# Altium project ATOL_MAIN_BOARD_R02A03_20191009.PrjPcb
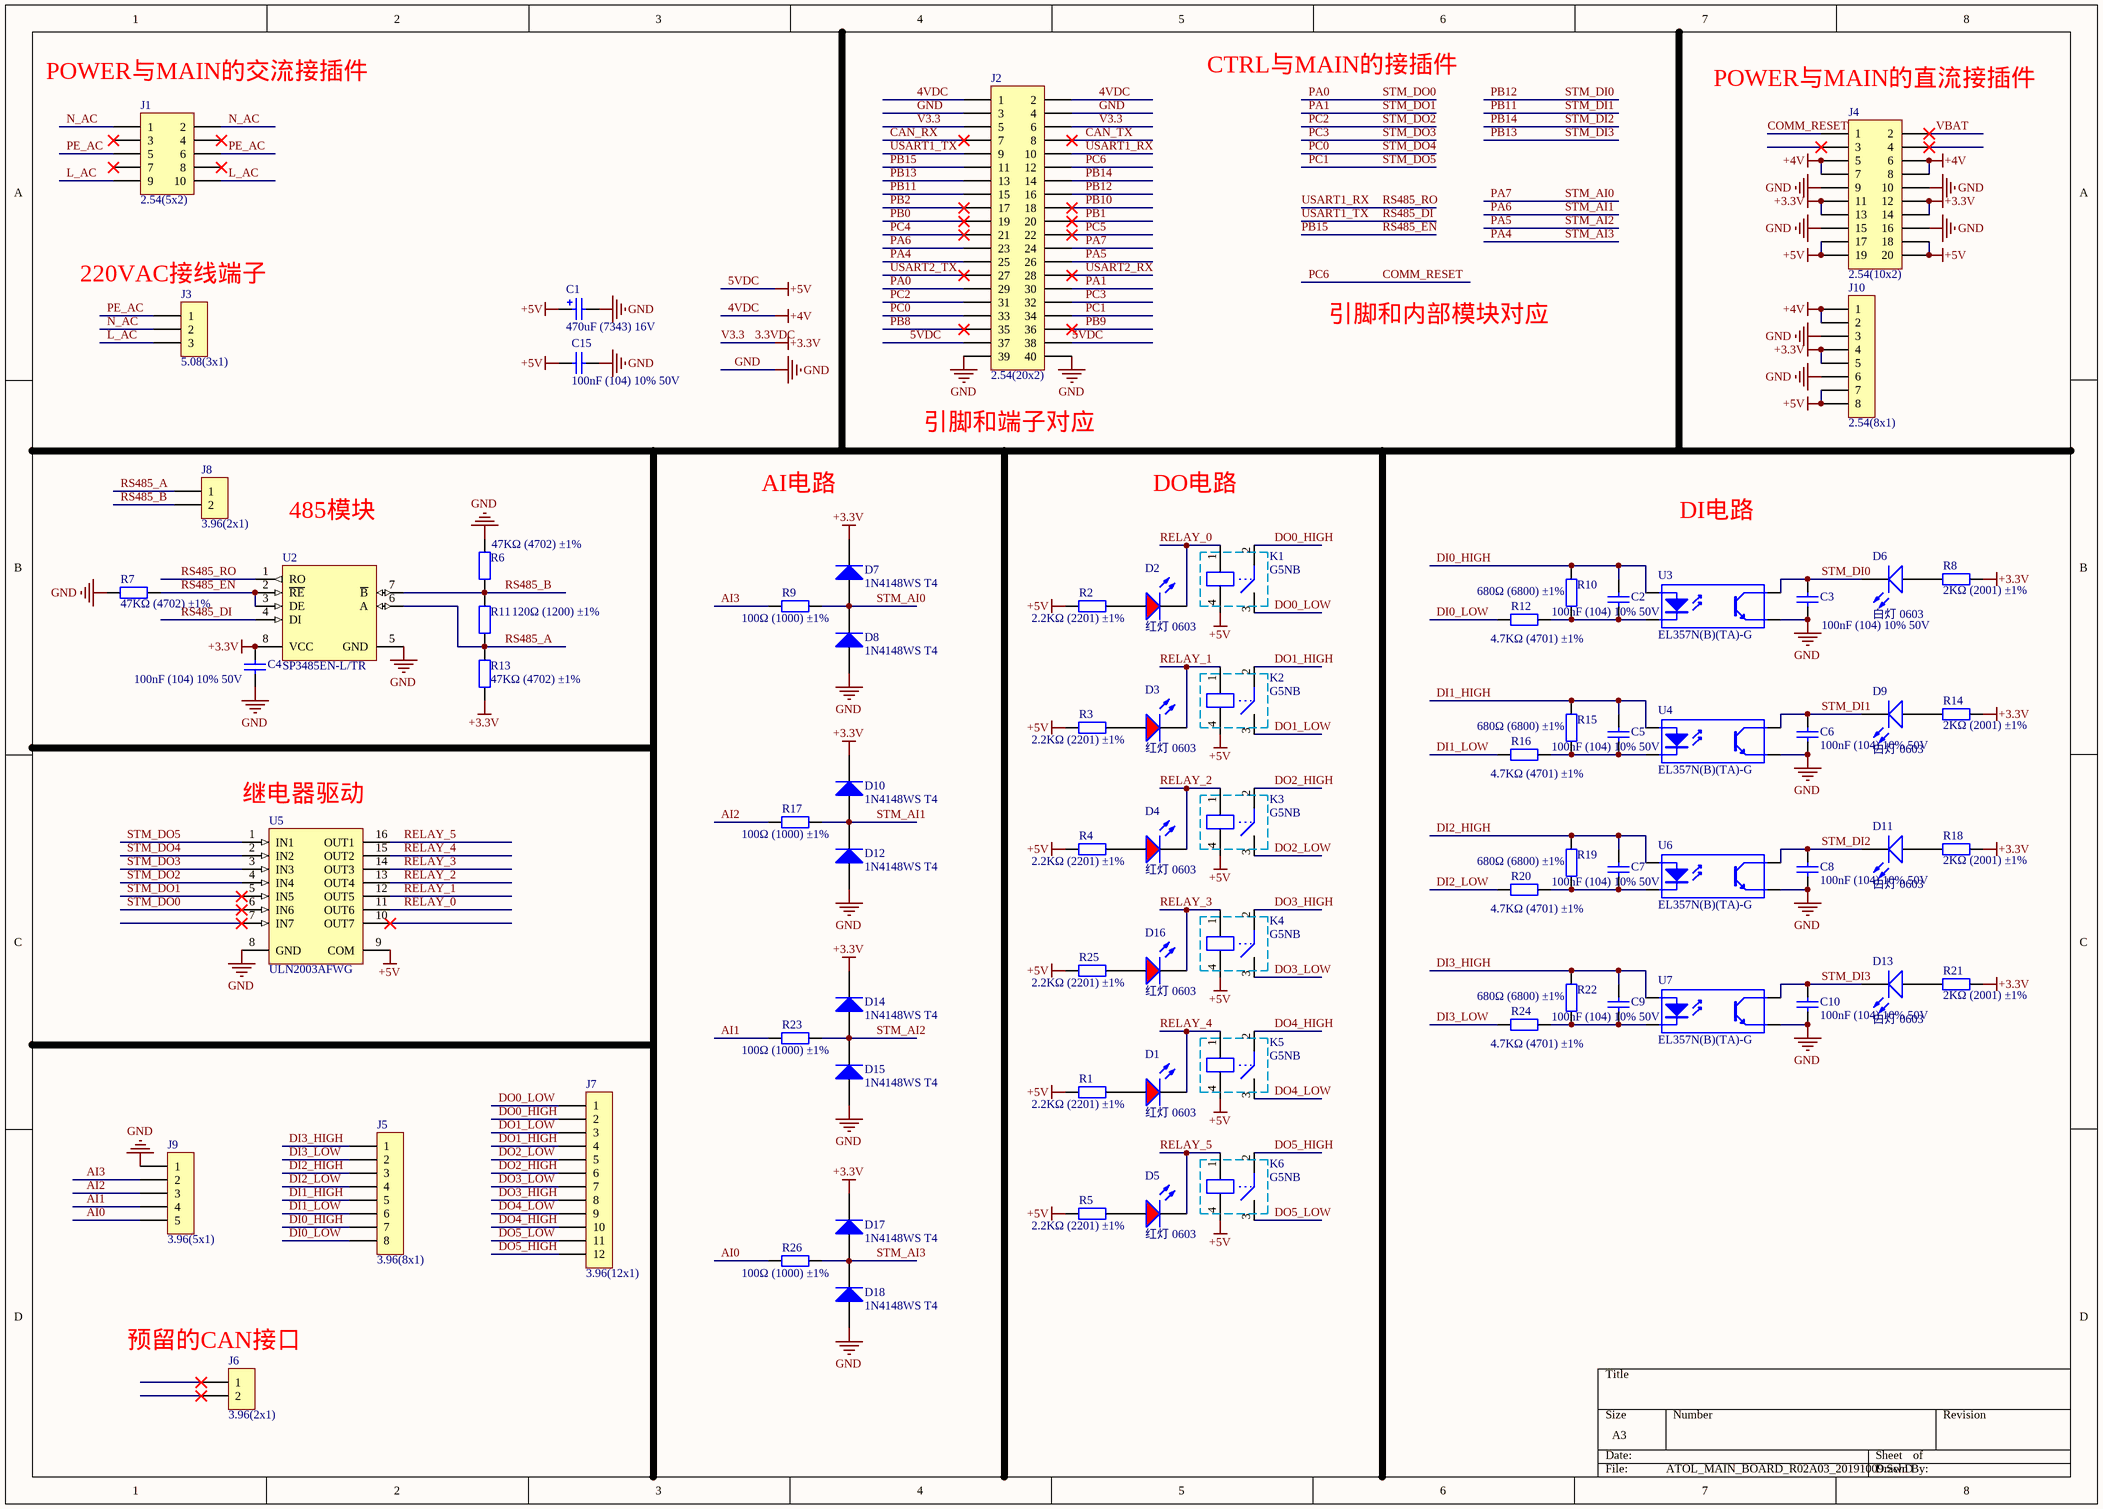
[diagram p0: ATOL_MAIN_BOARD_R02A03_20191009.SchDoc]
1 sheet, 77 parts. Net scope: global (net labels, ports and power ports of the same name join across sheets).
Board file: ATOL_MAIN_BOARD_R02A03_20191009.PcbDoc

## Sheet ATOL_MAIN_BOARD_R02A03_20191009.SchDoc
size A3

### Parts
C1  470uF (7343) 16V  [STEC_E(7343-43)]
C2  100nF (104) 10% 50V  [0603_C]
C3  100nF (104) 10% 50V  [0603_C]
C4  100nF (104) 10% 50V  [0603_C]
C5  100nF (104) 10% 50V  [0603_C]
C6  100nF (104) 10% 50V  [0603_C]
C7  100nF (104) 10% 50V  [0603_C]
C8  100nF (104) 10% 50V  [0603_C]
C9  100nF (104) 10% 50V  [0603_C]
C10  100nF (104) 10% 50V  [0603_C]
C15  100nF (104) 10% 50V  [0603_C]
D1  红灯 0603  [0603_LED_S1]
D2  红灯 0603  [0603_LED_S1]
D3  红灯 0603  [0603_LED_S1]
D4  红灯 0603  [0603_LED_S1]
D5  红灯 0603  [0603_LED_S1]
D6  白灯 0603  [0603_LED_S1]
D7  1N4148WS T4  [SOD-323]
D8  1N4148WS T4  [SOD-323]
D9  白灯 0603  [0603_LED_S1]
D10  1N4148WS T4  [SOD-323]
D11  白灯 0603  [0603_LED_S1]
D12  1N4148WS T4  [SOD-323]
D13  白灯 0603  [0603_LED_S1]
D14  1N4148WS T4  [SOD-323]
D15  1N4148WS T4  [SOD-323]
D16  红灯 0603  [0603_LED_S1]
D17  1N4148WS T4  [SOD-323]
D18  1N4148WS T4  [SOD-323]
J1  2.54(5x2)  [DB2.54(5x2)]
J2  2.54(20x2)  [DB2.54(20x2)]
J3  5.08(3x1)  [KF2EDGK5.08-WI-3P]
J4  2.54(10x2)  [DB2.54(10x2)]
J5  3.96(8x1)  [HT3.96-WI-8P]
J6  3.96(2x1)  [HT3.96-WI-2P]
J7  3.96(12x1)  [HT3.96-WI-12P]
J8  3.96(2x1)  [HT3.96-WI-2P]
J9  3.96(5x1)  [HT3.96-WI-5P]
J10  2.54(8x1)  [DB2.54(8x1)]
K1  G5NB  [G5NG]
K2  G5NB  [G5NG]
K3  G5NB  [G5NG]
K4  G5NB  [G5NG]
K5  G5NB  [G5NG]
K6  G5NB  [G5NG]
R1  2.2KΩ (2201) ±1%  [0603_R]
R2  2.2KΩ (2201) ±1%  [0603_R]
R3  2.2KΩ (2201) ±1%  [0603_R]
R4  2.2KΩ (2201) ±1%  [0603_R]
R5  2.2KΩ (2201) ±1%  [0603_R]
R6  47KΩ (4702) ±1%  [0603_R]
R7  47KΩ (4702) ±1%  [0603_R]
R8  2KΩ (2001) ±1%  [0603_R]
R9  100Ω (1000) ±1%  [0603_R]
R10  680Ω (6800) ±1%  [0603_R]
R11  120Ω (1200) ±1%  [0603_R]
R12  4.7KΩ (4701) ±1%  [0603_R]
R13  47KΩ (4702) ±1%  [0603_R]
R14  2KΩ (2001) ±1%  [0603_R]
R15  680Ω (6800) ±1%  [0603_R]
R16  4.7KΩ (4701) ±1%  [0603_R]
R17  100Ω (1000) ±1%  [0603_R]
R18  2KΩ (2001) ±1%  [0603_R]
R19  680Ω (6800) ±1%  [0603_R]
R20  4.7KΩ (4701) ±1%  [0603_R]
R21  2KΩ (2001) ±1%  [0603_R]
R22  680Ω (6800) ±1%  [0603_R]
R23  100Ω (1000) ±1%  [0603_R]
R24  4.7KΩ (4701) ±1%  [0603_R]
R25  2.2KΩ (2201) ±1%  [0603_R]
R26  100Ω (1000) ±1%  [0603_R]
U2  SP3485EN-L/TR  [SOIC-8_150mil]
U3  EL357N(B)(TA)-G  [SOP-4_P2.54]
U4  EL357N(B)(TA)-G  [SOP-4_P2.54]
U5  ULN2003AFWG  [SOIC-16_150mil]
U6  EL357N(B)(TA)-G  [SOP-4_P2.54]
U7  EL357N(B)(TA)-G  [SOP-4_P2.54]

### Nets
3.3VDC: C4.1 D7.2(K) D10.2(K) D14.2(K) D17.2(K) J2.5 J2.6 J4.11 J4.12 J4.13 J4.14 J10.4 J10.5 R8.2 R13.1 R14.2 R18.2 R21.2 U2.8(VCC)  [also labelled +3.3V, V3.3]
4VDC: J2.1 J2.2 J4.5 J4.6 J4.7 J4.8 J10.1 J10.2  [also labelled +4V]
5VDC: C1.1 C15.1 J2.37 J2.38 J4.17 J4.18 J4.19 J4.20 J10.7 J10.8 K1.4 K2.4 K3.4 K4.4 K5.4 K6.4 R1.1 R2.1 R3.1 R4.1 R5.1 R25.1 U5.9(COM)  [also labelled +5V]
GND: C1.2 C3.1 C4.2 C6.1 C8.1 C10.1 C15.2 D8.1(A) D12.1(A) D15.1(A) D18.1(A) J2.3 J2.4 J2.39 J2.40 J4.9 J4.10 J4.15 J4.16 J9.1 J10.3 J10.6 R6.2 R7.1 U2.5(GND) U3.3(E) U4.3(E) U5.8(GND) U6.3(E) U7.3(E)
AI0: J9.5 R26.1
AI1: J9.4 R23.1
AI2: J9.3 R17.1
AI3: J9.2 R9.1
CAN_RX: J2.7
CAN_TX: J2.8
COMM_RESET: J2.12 J4.1  [also labelled PC6]
DI0_HIGH: C2.2 J5.7 R10.1 U3.1(A)
DI0_LOW: J5.8 R12.2
DI1_HIGH: C5.2 J5.5 R15.1 U4.1(A)
DI1_LOW: J5.6 R16.2
DI2_HIGH: C7.2 J5.3 R19.1 U6.1(A)
DI2_LOW: J5.4 R20.2
DI3_HIGH: C9.2 J5.1 R22.1 U7.1(A)
DI3_LOW: J5.2 R24.2
DO0_HIGH: J7.2 K1.2
DO0_LOW: J7.1 K1.3
DO1_HIGH: J7.4 K2.2
DO1_LOW: J7.3 K2.3
DO2_HIGH: J7.6 K3.2
DO2_LOW: J7.5 K3.3
DO3_HIGH: J7.8 K4.2
DO3_LOW: J7.7 K4.3
DO4_HIGH: J7.10 K5.2
DO4_LOW: J7.9 K5.3
DO5_HIGH: J7.12 K6.2
DO5_LOW: J7.11 K6.3
L_AC: J1.9 J1.10 J3.3
N_AC: J1.1 J1.2 J3.2
PA0: J2.29 U5.6(IN6)  [also labelled STM_DO0]
PA1: J2.30 U5.5(IN5)  [also labelled STM_DO1]
PA4: D17.1(A) D18.2(K) J2.25 R26.2  [also labelled STM_AI3]
PA5: D14.1(A) D15.2(K) J2.26 R23.2  [also labelled STM_AI2]
PA6: D10.1(A) D12.2(K) J2.23 R17.2  [also labelled STM_AI1]
PA7: D7.1(A) D8.2(K) J2.24 R9.2  [also labelled STM_AI0]
PB0: J2.19
PB1: J2.20
PB2: J2.17
PB8: J2.35
PB9: J2.36
PB10: J2.18
PB11: C6.2 D9.K J2.15 U4.4(C)  [also labelled STM_DI1]
PB12: C3.2 D6.K J2.16 U3.4(C)  [also labelled STM_DI0]
PB13: C10.2 D13.K J2.13 U7.4(C)  [also labelled STM_DI3]
PB14: C8.2 D11.K J2.14 U6.4(C)  [also labelled STM_DI2]
PB15: J2.11 R7.2 U2.2(~{RE}) U2.3(DE)  [also labelled RS485_EN]
PC0: J2.33 U5.2(IN2)  [also labelled STM_DO4]
PC1: J2.34 U5.1(IN1)  [also labelled STM_DO5]
PC2: J2.31 U5.4(IN4)  [also labelled STM_DO2]
PC3: J2.32 U5.3(IN3)  [also labelled STM_DO3]
PC4: J2.21
PC5: J2.22
PE_AC: J1.5 J1.6 J3.1
RELAY_0: D2.K K1.1 U5.11(OUT6)
RELAY_1: D3.K K2.1 U5.12(OUT5)
RELAY_2: D4.K K3.1 U5.13(OUT4)
RELAY_3: D16.K K4.1 U5.14(OUT3)
RELAY_4: D1.K K5.1 U5.15(OUT2)
RELAY_5: D5.K K6.1 U5.16(OUT1)
RS485_A: J8.1 R11.1 R13.2 U2.6(A)
RS485_B: J8.2 R6.1 R11.2 U2.7(~{B})
RS485_DI: J2.9 U2.4(DI)  [also labelled USART1_TX]
RS485_RO: J2.10 U2.1(RO)  [also labelled USART1_RX]
USART2_RX: J2.28
USART2_TX: J2.27
VBAT: J4.2
NetC2_1: C2.1 R10.2 R12.1 U3.2(K)
NetC5_1: C5.1 R15.2 R16.1 U4.2(K)
NetC7_1: C7.1 R19.2 R20.1 U6.2(K)
NetC9_1: C9.1 R22.2 R24.1 U7.2(K)
NetD1_A: D1.A R1.2
NetD2_A: D2.A R2.2
NetD3_A: D3.A R3.2
NetD4_A: D4.A R4.2
NetD5_A: D5.A R5.2
NetD6_A: D6.A R8.1
NetD9_A: D9.A R14.1
NetD11_A: D11.A R18.1
NetD13_A: D13.A R21.1
NetD16_A: D16.A R25.2

Not connected (* = marked no-connect by the designer): J1 3* 4* 7* 8*; J4 3* 4*; J6 1* 2*; U5 7(IN7)* 10(OUT7)*

### Notes on the sheet
- (near J1) POWER与MAIN的交流接插件
- CTRL与MAIN的接插件
- (near J4) POWER与MAIN的直流接插件
- (near J3) 220VAC接线端子
- 引脚和内部模块对应
- 引脚和端子对应
- AI电路
- DO电路
- 485模块
- DI电路
- (near U5) 继电器驱动
- (near J6) 预留的CAN接口

### Library data of the parts
C1 = 3528 100uF (107) 10% 6.3V: 钽电容; ComponentLink1Description: 供应商链接; ComponentLink1URL: http://www.szlcsc.com/product/details_16815.html; Package: 3528; Supplier: LC; SuppliersPartNumber: C16133
C2-C10 C15 = 0603 100nF (104) 10% 50V: 贴片电容; ComponentLink1Description: 供应商链接; ComponentLink1URL: http://www.szlcsc.com/product/details_15331.html; Package: 0603; Supplier: LC; SuppliersPartNumber: C14663
D1-D5 D16 = 0603 红灯: 发光二极管; ComponentLink1Description: 供应商链接; ComponentLink1URL: http://www.szlcsc.com/product/details_2659.html; Package: 0603; Supplier: LC; SuppliersPartNumber: C2286
D6 D9 D11 D13 = 0603 白灯: 发光二极管; ComponentLink1Description: 供应商链接; ComponentLink1URL: http://www.szlcsc.com/product/details_2663.html; Package: 0603; Supplier: LC; SuppliersPartNumber: C2290
D7 D8 D10 D12 D14 D15 D17 D18 = SOD-323 1N4148WS T4: 二极管; ComponentLink1Description: 供应商链接; ComponentLink1URL: http://www.szlcsc.com/product/details_2485.html; Package: SOD-323; Supplier: LC; SuppliersPartNumber: C2128
J1 = 2.54(5x2): 2.54端子
J2 = 2.54(20x2): 2.54端子
J3 = 5.08(3x1): 5.08端子
J4 = 2.54(10x2): 2.54端子
J5 = 3.96(8x1): 3.96端子
J6 J8 = 3.96(2x1): 3.96端子
J7 = 3.96(12x1): 3.96端子
J9 = 3.96(5x1): 3.96端子
J10 = 2.54(8x1): 2.54端子
K1-K6 = G5NB: G5NB/12V/16mA/720R
R1-R5 R25 = 0603 2.2KΩ (2201) 1%: 贴片电阻; ComponentLink1Description: 供应商链接; ComponentLink1URL: http://www.szlcsc.com/product/details_4597.html; Package: 0603; Supplier: LC; SuppliersPartNumber: C4190
R6 R7 R13 = 0603 47KΩ (4702) 1%: 贴片电阻; ComponentLink1Description: 供应商链接; ComponentLink1URL: http://www.szlcsc.com/product/details_26562.html; Package: 0603; Supplier: LC; SuppliersPartNumber: C25819
R8 R14 R18 R21 = 0603 2KΩ (2001) 1%: 贴片电阻; ComponentLink1Description: 供应商链接; ComponentLink1URL: http://www.szlcsc.com/product/details_23702.html; Package: 0603; Supplier: LC; SuppliersPartNumber: C22975
R9 R17 R23 R26 = 0603 100Ω (1000) 1%: 贴片电阻; ComponentLink1Description: 供应商链接; ComponentLink1URL: http://www.szlcsc.com/product/details_23502.html; Package: 0603; Supplier: LC; SuppliersPartNumber: C22775
R10 R15 R19 R22 = 0603 680Ω (6800) 1%: 贴片电阻; ComponentLink1Description: 供应商链接; ComponentLink1URL: http://www.szlcsc.com/product/details_23955.html; Package: 0603; Supplier: LC; SuppliersPartNumber: C23228
R11 = 0603 120Ω (1200) 1%: 贴片电阻; ComponentLink1Description: 供应商链接; ComponentLink1URL: http://www.szlcsc.com/product/details_23514.html; Package: 0603; Supplier: LC; SuppliersPartNumber: C22787
R12 R16 R20 R24 = 0603 4.7KΩ (4701) 1%: 贴片电阻; ComponentLink1Description: 供应商链接; ComponentLink1URL: http://www.szlcsc.com/product/details_23889.html; Package: 0603; Supplier: LC; SuppliersPartNumber: C23162
U2 = SP3485EN-L/TR_[C8963]: RS-485/RS-422; ComponentLink1Description: 供应商链接; ComponentLink1URL: http://www.szlcsc.com/product/details_9482.html; Package: SOIC-8; Supplier: LC; SuppliersPartNumber: C8963
U3 U4 U6 U7 = EL357N(B)(TA)-G_[C6649]: 贴片光耦; ComponentLink1Description: 供应商链接; ComponentLink1URL: http://www.szlcsc.com/product/details_7114.html; Package: SOP-4_P2.54; Supplier: LC; SuppliersPartNumber: C6649
U5 = ULN2003AFWG_[C5437]: 大电流驱动; ComponentLink1Description: 供应商链接; ComponentLink1URL: http://www.szlcsc.com/product/details_5880.html; Package: SOIC-16_150mil; Supplier: LC; SuppliersPartNumber: C5437